# EAGLE schematic schema_zasuvka (EAGLE 7.6.0)
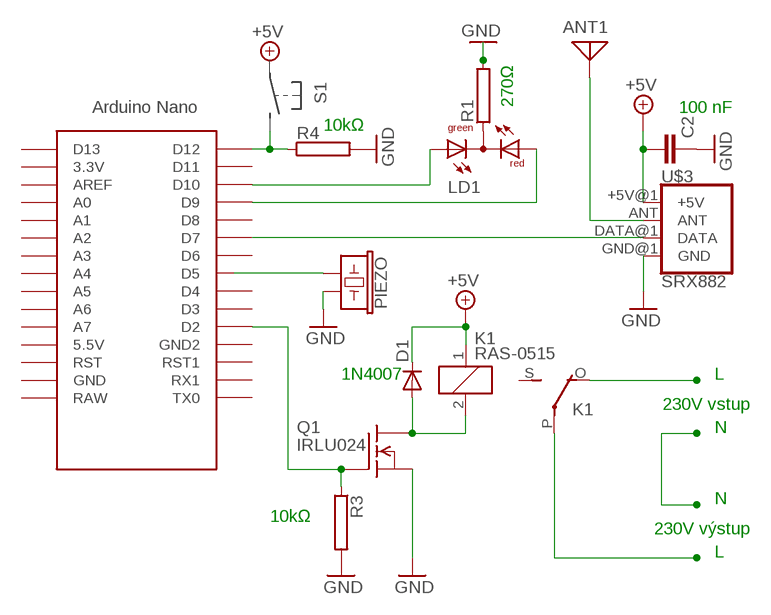
[diagram p0: schematic, sheet 1]

## Parts
ANT1  ANTENNA  [PAD-01]
C2  C5/5.5  [C5B5.5]
D1  1N4004  [DO41-10]
K1  RAS-0515  G5L  [G5LE]
LD1  DUOLED-RG-C  [DUOLED-C-5MM]
PIEZO  BUZZER-PTH_KIT  [BUZZER-12MM-KIT]
Q1  IRLU024  BUZ10  [TO220]
R1  RAC03  [AC03]
R3  RAC03  [AC03]
R4  RAC03  [AC03]
U$1  NANO  [NANO]
U$3  SRX882  RF-LINK_RX  [RF-LINK_RX]

## Nets
+5V: C2.2 D1.C K1.1 U$3.+5V@1(+5V)
GND: C2.1 PIEZO.+ Q1.3(S) R1.2 R3.2 R4.2 U$3.GND@1(GND)
N$1: U$1.D7 U$3.DATA@1(DATA)
N$2: LD1.AX(AG) U$1.D10
N$3: Q1.1(G) R3.1 U$1.D2
N$4: D1.A K1.2 Q1.2(D)
N$6: K1.O(2:O)
N$7: PIEZO.-
N$8: LD1.C R1.1
N$10: ANT1.1 U$3.ANT
N$11: K1.P(2:P)
N$12: R4.1 U$1.D12
N$13: LD1.AR U$1.D9
Unconnected: K1.S(2:S) U$1.3.3V U$1.5V(5.5V) U$1.A0 U$1.A1 U$1.A2 U$1.A3 U$1.A4 U$1.A5 U$1.A6 U$1.A7 U$1.AREF U$1.D3 U$1.D4 U$1.D5 U$1.D6 U$1.D8 U$1.D11 U$1.D13 U$1.GND U$1.GND1(GND2) U$1.ICSP1 U$1.ICSP2 U$1.ICSP3 U$1.ICSP4 U$1.ICSP5 U$1.ICSP6 U$1.RAW U$1.RST U$1.RST1 U$1.RX1 U$1.TX0

## Notes on the sheet
- 270Ω
- 100 nF
- 10kΩ
- 1N4007 | L
- 230V vstup
- N
- N
- 10kΩ | 230V výstup
- L

## Library data of the parts
ANT1 = discrete:ANTENNA: Antenna
C2 = capacitor-wima:C: CAPACITOR naming: grid - package width
D1 = diode:1N4004: DIODE general purpose rectifier, 1 A
K1 = relay:G5L: RELAY 1 x switch, 10 A/120 V AC, 8 A/30 V ADC, Omron; OC_FARNELL: unknown; OC_NEWARK: unknown
LD1 = led:DUOLED-RG-C: DUO LED 2 colors (red/green), 5 mm, round, common Cathode www.ligitek.com or other producers.
PIEZO = SparkFun-Electromechanical:BUZZER: Buzzer Small round buzzers that operate around the audible 2kHz range. You can use these as speakers to create simple music or user interfaces. Variant Overview: PTH - Mini Speaker - PC Mount 12mm 2.048kHz <https://www.sparkfun.com/products/7950> PTH_KIT - Mini Speaker - PC Mount 12mm 2.048kHz <https://www.sparkfun.com/products/7950> KIT simplifies soldering by adding stop mask to one side of the pads. PTH_NO_SILK - Mini Speaker - PC Mount 12mm 2.048kHz <https://www.sparkfun.com/products/7950> No silkscreen indicator of buzzer outline. PTH_KIT_NO_SILK - Mini Speaker - PC Mount 12mm 2.048kHz <https://www.sparkfun.com/products/7950> KIT package w/o silkscreen SMD - Buzzer Audio Magnetic (CCV-084B16) SMD buzzer used on, e.g. the LilyPad Buzzer <https://www.sparkfun.com/products/8463> and RFID USB Reader <https://www.sparkfun.com/products/9963>. SMD_KIT - Buzzer Audio Magnetic (CCV-084B16) SMD Buzzer with elongated pins to make soldering easier. Used on the SparkFun Simon Says - Surface Mount Soldering Kit <https://www.sparkfun.com/products/10935>.; PROD_ID: COMP-08253; SF_SKU: COM-07950
Q1 = transistor-fet:BUZ10: N-Channel Enhancement MOSFET 50V; 20A; 0,080Ohm
R1 R3 R4 = resistor-power:R: Power Resitor; OC_FARNELL: unknown; OC_NEWARK: unknown
U$1 = Arduino-clone:NANO: Arduino Nano
U$3 = SparkFun-RF:RF-LINK_RX: RF Link Receiver (434 MHz, 315 MHz) These wireless receivers work with equivalent transmitters. They can easily fit into a breadboard and work well with microcontrollers to create a very simple wireless data link. Since these are only receivers, they will only work communicating data one-way, you would need two pairs (of different frequencies) to act as a transmitter/receiver pair.. SparkFun Products RF Link Receiver - 4800bps (434 MHz) <https://www.sparkfun.com/products/10532>(WRL-10532); SF_ID: WRL-10533